# Altium schematic sheet HIREARCHY.SchDoc: MISKO3
size A4; Date: 19.9.2021; Author: AMADEJ PAPEŽ; SheetNumber: 1; SheetTotal: 13; SheetTitle: HIREARCHY; Version: V1.1
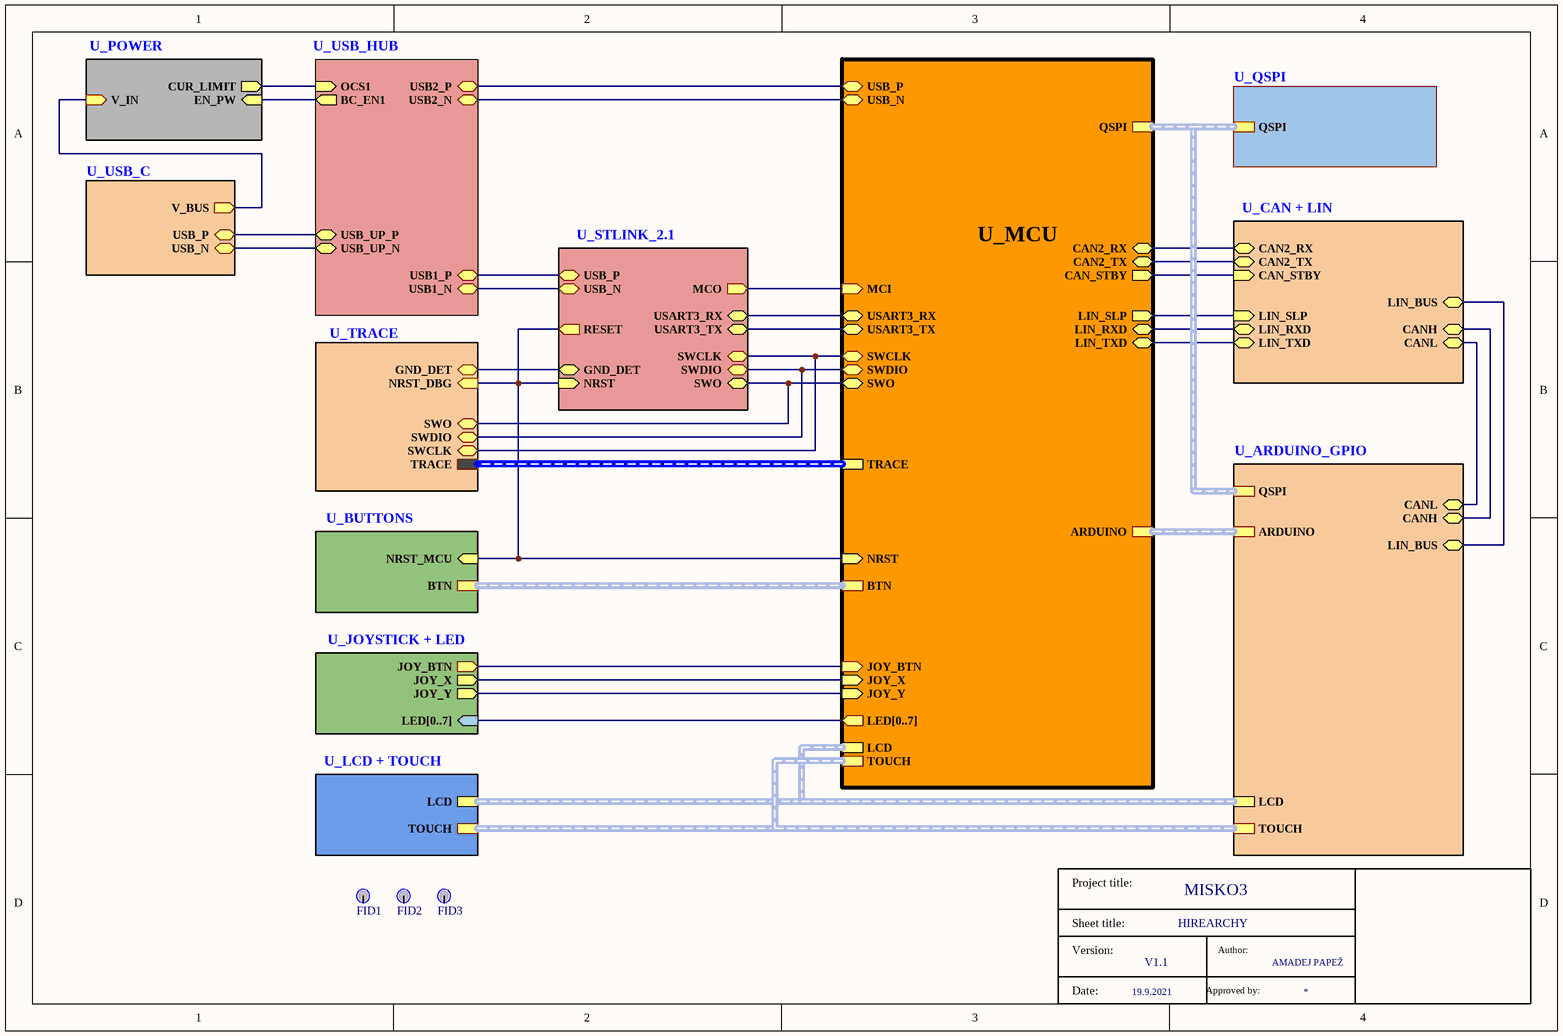
[diagram p0: HIREARCHY.SchDoc]

## Parts
FID1  Fiducial  [Fiducial]  (value not drawn)
FID2  Fiducial  [Fiducial]  (value not drawn)
FID3  Fiducial  [Fiducial]  (value not drawn)
T1  (no value)

## Sub-sheets
U_ARDUINO_GPIO = ARDUINO_GPIO.SchDoc: LIN_BUS (bidir), CANH (bidir), CANL (bidir), LCD (harness LCD), TOUCH (harness TOUCH), ARDUINO (harness ARDUINO), QSPI (harness QSPI)
U_BUTTONS = BUTTONS.SchDoc: NRST_MCU (in), BTN (harness BTN)
U_CAN + LIN = CAN + LIN.SchDoc: LIN_SLP (in), LIN_RXD (bidir), LIN_TXD (bidir), LIN_BUS (bidir), CAN_STBY (in), CAN2_TX (bidir), CAN2_RX (bidir), CANH (bidir), CANL (bidir)
U_JOYSTICK + LED = JOYSTICK + LED.SchDoc: JOY_X (out), JOY_Y (out), LED[0..7] (in, harness LED_BUS), JOY_BTN (out)
U_LCD + TOUCH = LCD + TOUCH .SchDoc: LCD (harness LCD), TOUCH (harness TOUCH)
U_MCU = MCU.SchDoc: CAN_STBY (out), JOY_Y (in), JOY_X (in), CAN2_TX (bidir), CAN2_RX (bidir), TRACE (harness TRACE), LIN_TXD (bidir), NRST (in), SWO (bidir), LIN_SLP (out), LIN_RXD (bidir), MCI (in), SWDIO (bidir), SWCLK (bidir), JOY_BTN (in), USB_N (bidir), USB_P (bidir), LCD (harness LCD), TOUCH (harness TOUCH), QSPI (harness QSPI), BTN (harness BTN), LED[0..7] (out, harness LED), ARDUINO (harness ARDUINO), USART3_TX (bidir), USART3_RX (bidir)
U_POWER = POWER.SchDoc: EN_PW (in), CUR_LIMIT (out), V_IN (in)
U_QSPI = QSPI.SchDoc: QSPI (harness QSPI)
U_STLINK_2.1 = STLINK_2.1.SchDoc: GND_DET (bidir), USART3_RX (bidir), USART3_TX (bidir), SWO (bidir), NRST (in), MCO (out), SWCLK (bidir), SWDIO (bidir), USB_P (bidir), USB_N (bidir), RESET (out)
U_TRACE = Trace.SchDoc: GND_DET (bidir), TRACE (harness TRACE), NRST_DBG (in), SWO (bidir), SWCLK (bidir), SWDIO (bidir)
U_USB_C = USB_C.SchDoc: USB_P (bidir), USB_N (bidir), V_BUS (out)
U_USB_HUB = USB_HUB.SchDoc: USB_UP_P (bidir), USB_UP_N (bidir), BC_EN1 (out), OCS1 (in), USB2_N (bidir), USB2_P (bidir), USB1_N (bidir), USB1_P (bidir)

## Nets
(unnamed): sheet U_BUTTONS/NRST_MCU, sheet U_STLINK_2.1/NRST, sheet U_STLINK_2.1/RESET, sheet U_MCU/NRST, sheet U_TRACE/NRST_DBG
(unnamed): sheet U_ARDUINO_GPIO/LIN_BUS, sheet U_CAN + LIN/LIN_BUS
(unnamed): sheet U_ARDUINO_GPIO/CANH, sheet U_CAN + LIN/CANH
(unnamed): sheet U_ARDUINO_GPIO/CANL, sheet U_CAN + LIN/CANL
(unnamed): sheet U_POWER/EN_PW, sheet U_USB_HUB/BC_EN1
(unnamed): sheet U_POWER/CUR_LIMIT, sheet U_USB_HUB/OCS1
(unnamed): sheet U_POWER/V_IN, sheet U_USB_C/V_BUS
(unnamed): sheet U_USB_HUB/USB_UP_P, sheet U_USB_C/USB_P
(unnamed): sheet U_USB_HUB/USB_UP_N, sheet U_USB_C/USB_N
(unnamed): sheet U_USB_HUB/USB2_N, sheet U_MCU/USB_N
(unnamed): sheet U_USB_HUB/USB2_P, sheet U_MCU/USB_P
(unnamed): sheet U_USB_HUB/USB1_N, sheet U_STLINK_2.1/USB_N
(unnamed): sheet U_USB_HUB/USB1_P, sheet U_STLINK_2.1/USB_P
(unnamed): sheet U_JOYSTICK + LED/JOY_X, sheet U_MCU/JOY_X
(unnamed): sheet U_JOYSTICK + LED/JOY_Y, sheet U_MCU/JOY_Y
(unnamed): sheet U_JOYSTICK + LED/JOY_BTN, sheet U_MCU/JOY_BTN
(unnamed): sheet U_CAN + LIN/LIN_SLP, sheet U_MCU/LIN_SLP
(unnamed): sheet U_CAN + LIN/LIN_RXD, sheet U_MCU/LIN_RXD
(unnamed): sheet U_CAN + LIN/LIN_TXD, sheet U_MCU/LIN_TXD
(unnamed): sheet U_CAN + LIN/CAN_STBY, sheet U_MCU/CAN_STBY
(unnamed): sheet U_CAN + LIN/CAN2_TX, sheet U_MCU/CAN2_TX
(unnamed): sheet U_CAN + LIN/CAN2_RX, sheet U_MCU/CAN2_RX
(unnamed): sheet U_STLINK_2.1/GND_DET, sheet U_TRACE/GND_DET
(unnamed): sheet U_STLINK_2.1/USART3_RX, sheet U_MCU/USART3_RX
(unnamed): sheet U_STLINK_2.1/USART3_TX, sheet U_MCU/USART3_TX
(unnamed): sheet U_STLINK_2.1/SWO, sheet U_MCU/SWO, sheet U_TRACE/SWO
(unnamed): sheet U_STLINK_2.1/MCO, sheet U_MCU/MCI
(unnamed): sheet U_STLINK_2.1/SWCLK, sheet U_MCU/SWCLK, sheet U_TRACE/SWCLK
(unnamed): sheet U_STLINK_2.1/SWDIO, sheet U_MCU/SWDIO, sheet U_TRACE/SWDIO

Not connected (* = marked no-connect by the designer): FID1 F; FID2 F; FID3 F

## Buses and harness runs
harness sheet U_ARDUINO_GPIO/ARDUINO = sheet U_MCU/ARDUINO
harness sheet U_ARDUINO_GPIO/LCD = sheet U_LCD + TOUCH/LCD = sheet U_MCU/LCD
harness sheet U_ARDUINO_GPIO/QSPI = sheet U_MCU/QSPI = sheet U_QSPI/QSPI
harness sheet U_ARDUINO_GPIO/TOUCH = sheet U_LCD + TOUCH/TOUCH = sheet U_MCU/TOUCH
harness sheet U_BUTTONS/BTN = sheet U_MCU/BTN
harness sheet U_MCU/TRACE = sheet U_TRACE/TRACE

## Notes on the sheet
- (in symbol Title block) Project title:; Sheet title:; Version:; Author:; Date:; Approved by:

## Library data of the parts
FID1-FID3 = Fiducial: according to IPC-7351 - is a 1mm diameter round dot with 2mm solder mask opening; Voltage: 50V; Tolerance: 5%; max.Temperature: +125; min.Temperature: -40
T1 = Title block